# Altium schematic sheet eps_digital.SchDoc: Digital Top Level
size A4; DrawnBy: J. Reimer T. Yeung M. Au; Organization: UTAT SS; DocumentNumber: 7; Revision: 2.0; SheetNumber: 7; SheetTotal: 17
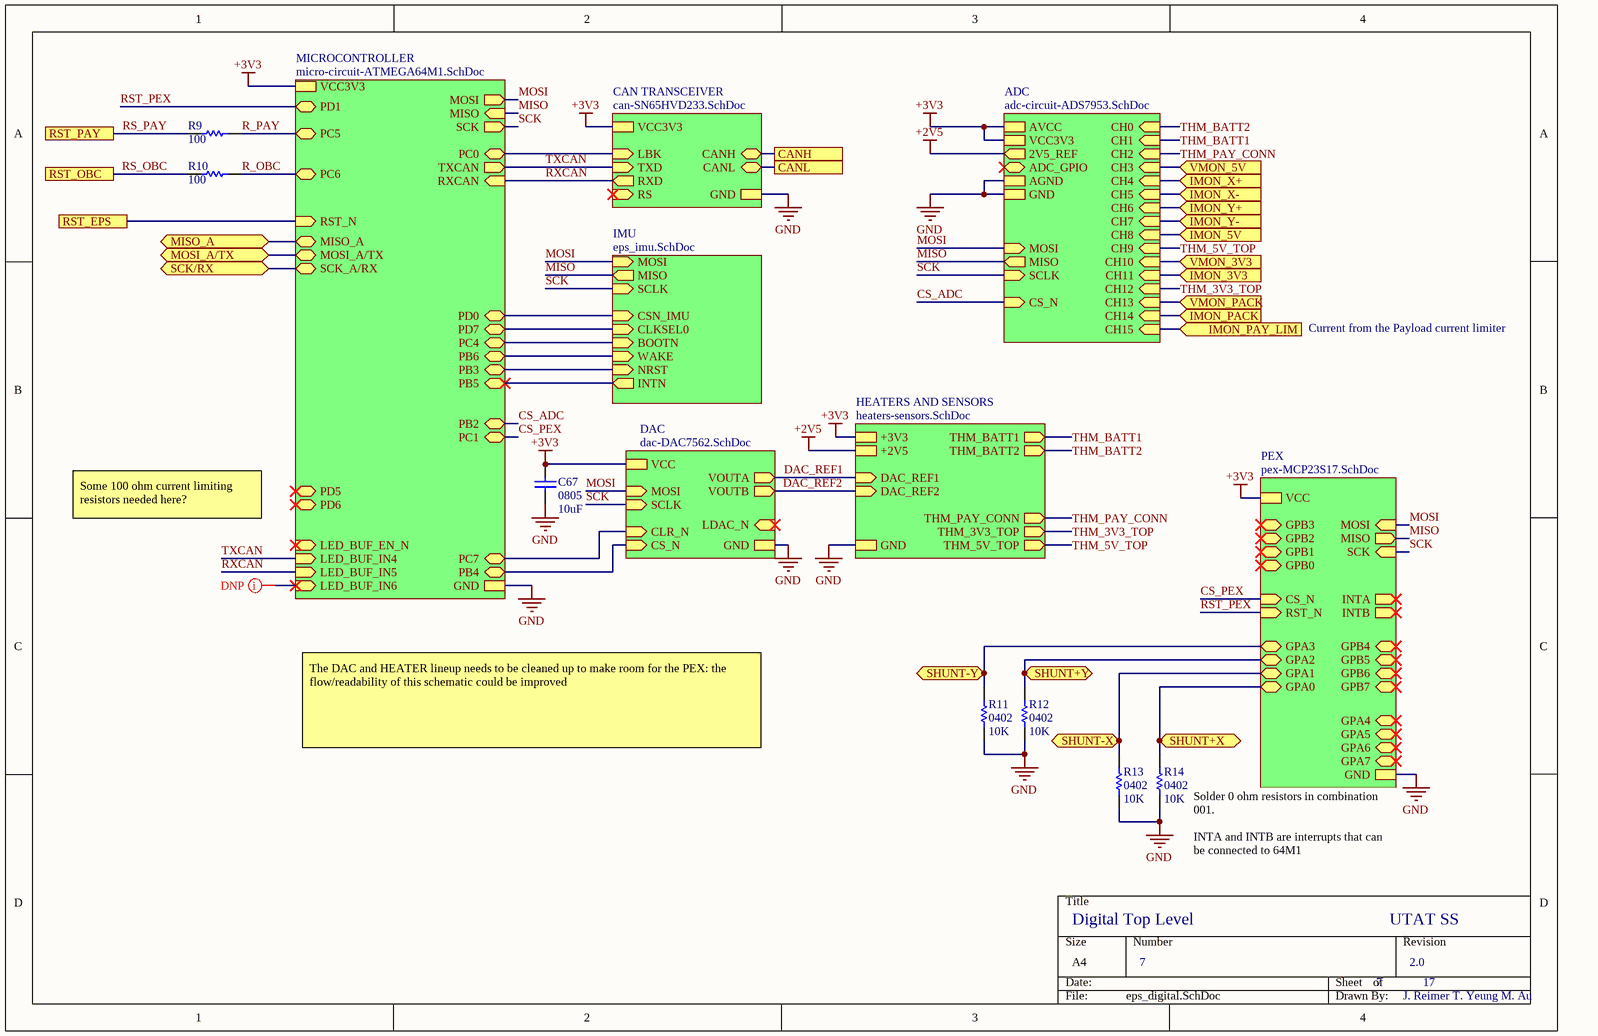
[diagram p0: eps_digital.SchDoc]

## Parts
C67  0805  value 10uF  [CAP0805R]
R9  value 100  [RES0402R]  (hidden comment: 0402)
R10  value 100  [RES0402R]  (hidden comment: 0402)
R11  0402  value 10K  [RES0402R]
R12  0402  value 10K  [RES0402R]
R13  0402  value 10K  [RES0402R]
R14  0402  value 10K  [RES0402R]

## Sub-sheets
ADC = adc-circuit-ADS7953.SchDoc: CH10 (in), CH11 (in), CH9 (in), CH5 (in), CH6 (in), CH7 (in), CH3 (in), CH2 (in), CH8 (in), CH4 (in), CH1 (in), CH0 (in), CS_N (in), AVCC, ADC_GPIO (bidir), 2V5_REF (out), VCC3V3, AGND, GND, MISO (out), MOSI (in), SCLK (in), CH12 (in), CH14 (in), CH13 (in), CH15 (in)
CAN TRANSCEIVER = can-SN65HVD233.SchDoc: RXD (out), TXD (in), LBK (in), CANL (bidir), CANH (bidir), RS (in), VCC3V3, GND
DAC = dac-DAC7562.SchDoc: MOSI (in), CLR_N (in), SCLK (in), CS_N (in), VOUTB (out), VOUTA (out), VCC, GND, LDAC_N (in)
HEATERS AND SENSORS = heaters-sensors.SchDoc: +2V5, DAC_REF1 (in), GND, DAC_REF2 (in), +3V3, THM_BATT1 (out), THM_BATT2 (out), THM_3V3_TOP (out), THM_5V_TOP (out), THM_PAY_CONN (out)
IMU = eps_imu.SchDoc: NRST (in), CSN_IMU (in), MISO (out), CLKSEL0 (in), WAKE (in), BOOTN (in), INTN (out), SCLK (in), MOSI (in)
MICROCONTROLLER = micro-circuit-ATMEGA64M1.SchDoc: MOSI_A/TX (bidir), TXCAN (out), RXCAN (in), SCK_A/RX (bidir), PC6 (bidir), PC5 (bidir), PD1 (bidir), PB5 (bidir), PC1 (bidir), PB2 (bidir), RST_N (in), PC0 (bidir), MISO_A (bidir), PB4 (bidir), PD7 (bidir), PB3 (bidir), VCC3V3, PB6 (bidir), PD6 (bidir), GND, LED_BUF_IN6 (in), LED_BUF_IN5 (in), LED_BUF_IN4 (in), LED_BUF_EN_N (in), PD0 (bidir), PD5 (bidir), PC4 (bidir), PC7 (bidir), MISO (in), SCK (out), MOSI (out)
PEX = pex-MCP23S17.SchDoc: GPB0 (bidir), GPB1 (bidir), GPB2 (bidir), GPB3 (bidir), GPA1 (bidir), GPA2 (bidir), GPA0 (bidir), GPA3 (bidir), CS_N (in), RST_N (in), MISO (out), MOSI (in), SCK (in), GND, INTB (out), INTA (out), VCC, GPB6 (bidir), GPA6 (bidir), GPB5 (bidir), GPB7 (bidir), GPA4 (bidir), GPA5 (bidir), GPA7 (bidir), GPB4 (bidir)

## Ports
CANH, CANL, IMON_3V3 (in), IMON_5V (in), IMON_PACK (in), IMON_PAY_LIM (in), IMON_X+ (in), IMON_X- (in), IMON_Y+ (in), IMON_Y- (in), MISO_A (bidir), MOSI_A/TX (bidir), RST_EPS, RST_OBC, RST_PAY, SCK/RX (bidir), SHUNT+X (bidir), SHUNT+Y (bidir), SHUNT-X (bidir), SHUNT-Y (bidir), VMON_3V3 (in), VMON_5V (in), VMON_PACK (in)

## Nets
+2V5: sheet ADC/2V5_REF, sheet HEATERS AND SENSORS/+2V5
+3V3: C67.2 ; sheet MICROCONTROLLER/VCC3V3, sheet DAC/VCC, sheet ADC/AVCC, sheet ADC/VCC3V3, sheet HEATERS AND SENSORS/+3V3, sheet CAN TRANSCEIVER/VCC3V3, sheet PEX/VCC
GND: C67.1 R11.1 R12.1 R13.1 R14.1 ; sheet MICROCONTROLLER/GND, sheet DAC/GND, sheet ADC/AGND, sheet ADC/GND, sheet HEATERS AND SENSORS/GND, sheet CAN TRANSCEIVER/GND, sheet PEX/GND
CANH: port CANH, sheet CAN TRANSCEIVER/CANH
CANL: port CANL, sheet CAN TRANSCEIVER/CANL
CS_ADC: sheet MICROCONTROLLER/PB2, sheet ADC/CS_N
CS_PEX: sheet MICROCONTROLLER/PC1, sheet PEX/CS_N
DAC_REF1: sheet DAC/VOUTA, sheet HEATERS AND SENSORS/DAC_REF1
DAC_REF2: sheet DAC/VOUTB, sheet HEATERS AND SENSORS/DAC_REF2
IMON_3V3: port IMON_3V3, sheet ADC/CH11
IMON_5V: port IMON_5V, sheet ADC/CH8
IMON_PACK: port IMON_PACK, sheet ADC/CH14
IMON_PAY_LIM: port IMON_PAY_LIM, sheet ADC/CH15
IMON_X+: port IMON_X+, sheet ADC/CH4
IMON_X-: port IMON_X-, sheet ADC/CH5
IMON_Y+: port IMON_Y+, sheet ADC/CH6
IMON_Y-: port IMON_Y-, sheet ADC/CH7
MISO: sheet MICROCONTROLLER/MISO, sheet ADC/MISO, sheet IMU/MISO, sheet PEX/MISO
MISO_A: port MISO_A, sheet MICROCONTROLLER/MISO_A
MOSI: sheet MICROCONTROLLER/MOSI, sheet DAC/MOSI, sheet ADC/MOSI, sheet IMU/MOSI, sheet PEX/MOSI
MOSI_A/TX: port MOSI_A/TX, sheet MICROCONTROLLER/MOSI_A/TX
R_OBC: R10.2 ; sheet MICROCONTROLLER/PC6
R_PAY: R9.2 ; sheet MICROCONTROLLER/PC5
RS_OBC: R10.1 ; port RST_OBC
RS_PAY: R9.1 ; port RST_PAY
RST_EPS: port RST_EPS, sheet MICROCONTROLLER/RST_N
RST_PEX: sheet MICROCONTROLLER/PD1, sheet PEX/RST_N
RXCAN: sheet MICROCONTROLLER/RXCAN, sheet MICROCONTROLLER/LED_BUF_IN5, sheet CAN TRANSCEIVER/RXD
SCK: sheet MICROCONTROLLER/SCK, sheet DAC/SCLK, sheet ADC/SCLK, sheet IMU/SCLK, sheet PEX/SCK
SCK/RX: port SCK/RX, sheet MICROCONTROLLER/SCK_A/RX
SHUNT+X: R14.2 ; port SHUNT+X, sheet PEX/GPA0
SHUNT+Y: R12.2 ; port SHUNT+Y, sheet PEX/GPA2
SHUNT-X: R13.2 ; port SHUNT-X, sheet PEX/GPA1
SHUNT-Y: R11.2 ; port SHUNT-Y, sheet PEX/GPA3
THM_3V3_TOP: sheet ADC/CH12, sheet HEATERS AND SENSORS/THM_3V3_TOP
THM_5V_TOP: sheet ADC/CH9, sheet HEATERS AND SENSORS/THM_5V_TOP
THM_BATT1: sheet ADC/CH1, sheet HEATERS AND SENSORS/THM_BATT1
THM_BATT2: sheet ADC/CH0, sheet HEATERS AND SENSORS/THM_BATT2
THM_PAY_CONN: sheet ADC/CH2, sheet HEATERS AND SENSORS/THM_PAY_CONN
TXCAN: sheet MICROCONTROLLER/TXCAN, sheet MICROCONTROLLER/LED_BUF_IN4, sheet CAN TRANSCEIVER/TXD
VMON_3V3: port VMON_3V3, sheet ADC/CH10
VMON_5V: port VMON_5V, sheet ADC/CH3
VMON_PACK: port VMON_PACK, sheet ADC/CH13
(unnamed): sheet MICROCONTROLLER/PB5, sheet IMU/INTN
(unnamed): sheet MICROCONTROLLER/PC0, sheet CAN TRANSCEIVER/LBK
(unnamed): sheet MICROCONTROLLER/PB4, sheet DAC/CS_N
(unnamed): sheet MICROCONTROLLER/PD7, sheet IMU/CLKSEL0
(unnamed): sheet MICROCONTROLLER/PB3, sheet IMU/NRST
(unnamed): sheet MICROCONTROLLER/PB6, sheet IMU/WAKE
(unnamed): sheet MICROCONTROLLER/PD0, sheet IMU/CSN_IMU
(unnamed): sheet MICROCONTROLLER/PC4, sheet IMU/BOOTN
(unnamed): sheet MICROCONTROLLER/PC7, sheet DAC/CLR_N

## Layout directives
mark named DNP: (no net found under the mark)

## Notes on the sheet
- Current from the Payload current limiter
- Some 100 ohm current limiting resistors needed here?
- The DAC and HEATER lineup needs to be cleaned up to make room for the PEX: the flow/readability of this schematic could be improved
- (near R14) Solder 0 ohm resistors in combination 001.
  INTA and INTB are interrupts that can be connected to 64M1

## Library data of the parts
C67 = CAP0805: 0805 capacitor
R9-R14 = RES0402: 0402 resistor